# Altium schematic sheet SWD-USB.SchDoc
size Letter; Organization: Altium Limited; Address1: L3, 12a Rodborough Rd; Address2: Frenchs Forest; Address3: NSW; Address4: Australia 2086
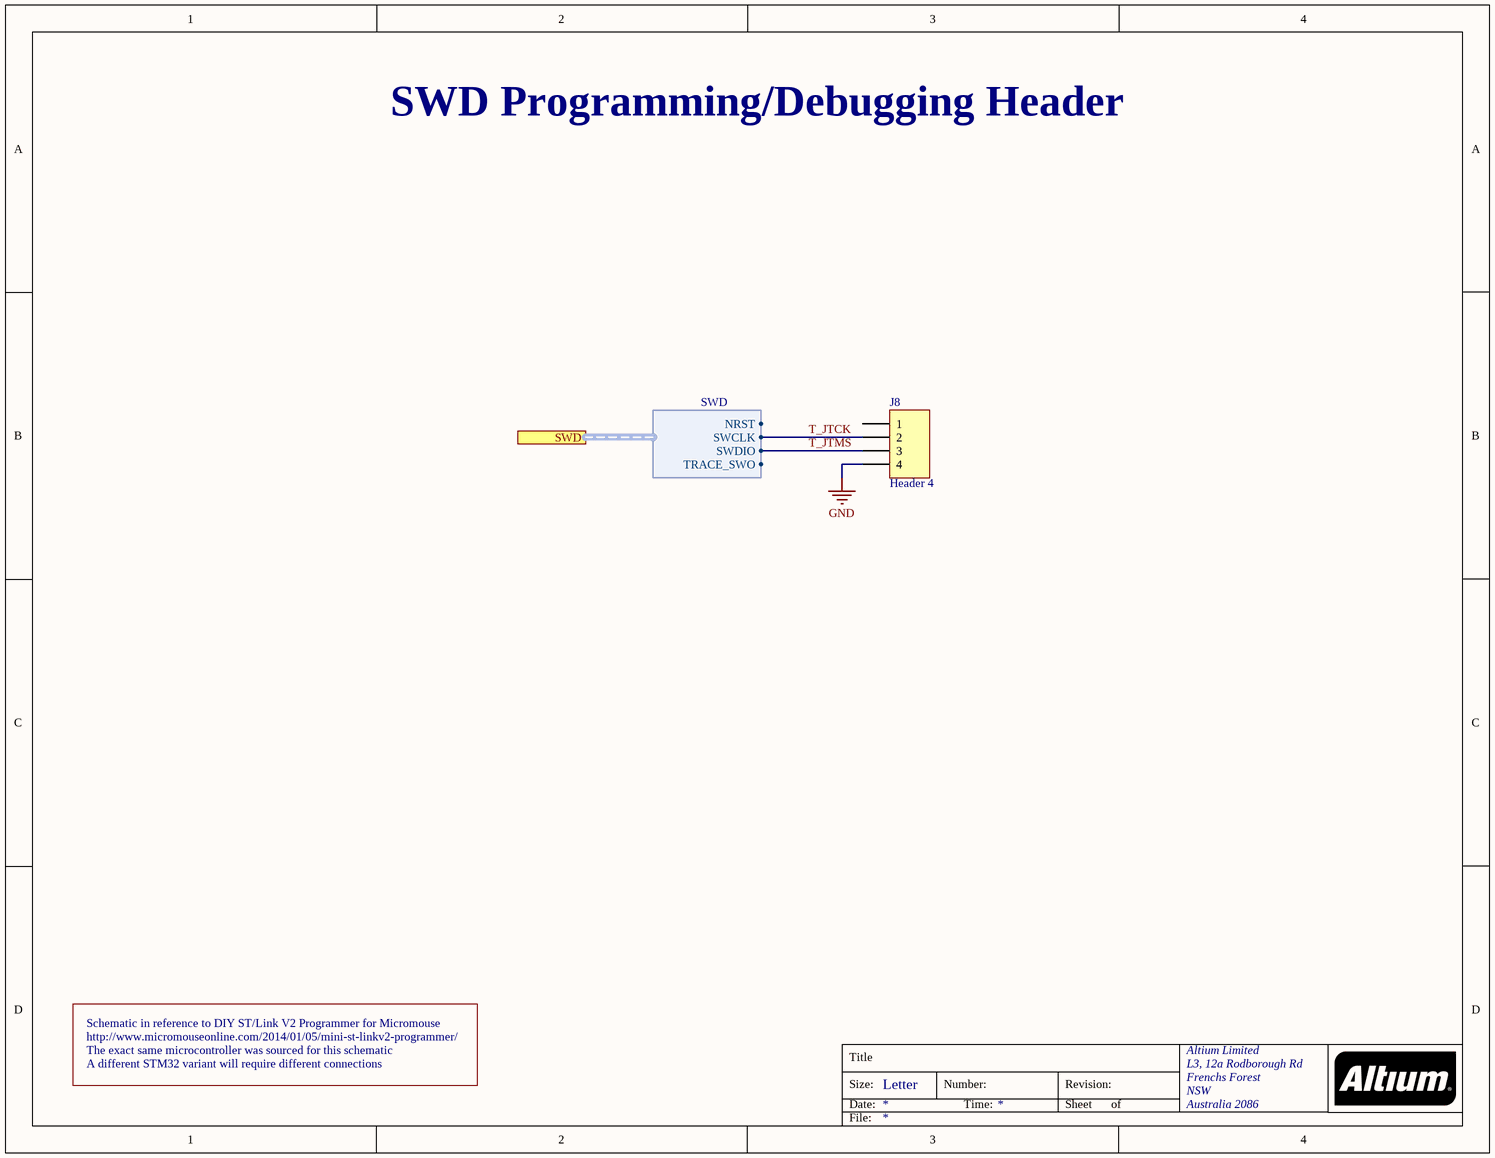
[diagram p0: SWD-USB.SchDoc]

## Parts
J8  Header 4  [HDR1X4]

## Ports
SWD (harness SWD)

## Harnesses
SWD: NRST, SWCLK, SWDIO, TRACE_SWO

## Nets
GND: J8.4
T_JTCK: J8.2 ; port SWD.SWCLK
T_JTMS: J8.3 ; port SWD.SWDIO

Not connected (* = marked no-connect by the designer): J8 1

## Notes on the sheet
- SWD Programming/Debugging Header
- http://www.micromouseonline.com/2014/01/05/mini-st-linkv2-programmer/
- Schematic in reference to DIY ST/Link V2 Programmer for Micromouse
- The exact same microcontroller was sourced for this schematic
- A different STM32 variant will require different connections
- Title
- Size:
- Date:
- Letter
- Number:
- Time:
- Revision:
- Sheet
- of
- File:

## Library data of the parts
J8 = Header 4: Header, 4-Pin; LatestRevisionDate: 17-Jul-2002; LatestRevisionNote: Re-released for DXP Platform.; Publisher: Altium Limited